# Altium project FrontPlate.PrjPcb
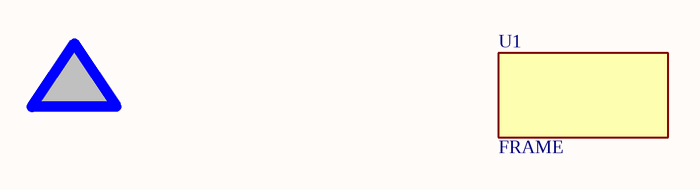
[diagram p0: FrontPlate.SchDoc]
1 sheet, 2 parts. Net scope: global (net labels, ports and power ports of the same name join across sheets).
Board file: FrontPlate.PcbDoc

## Sheet FrontPlate.SchDoc
size A4

### Parts
1  Warning  [Warning]  (value not drawn)
U1  FRAME  [FRAME]